# EAGLE schematic Pix_Caster (EAGLE 9.6.1)
CDES: Christian SoC Krueger; CNAME: Blizzard Bridge; CREV: 0.0.1

## Sheet 1 of 8
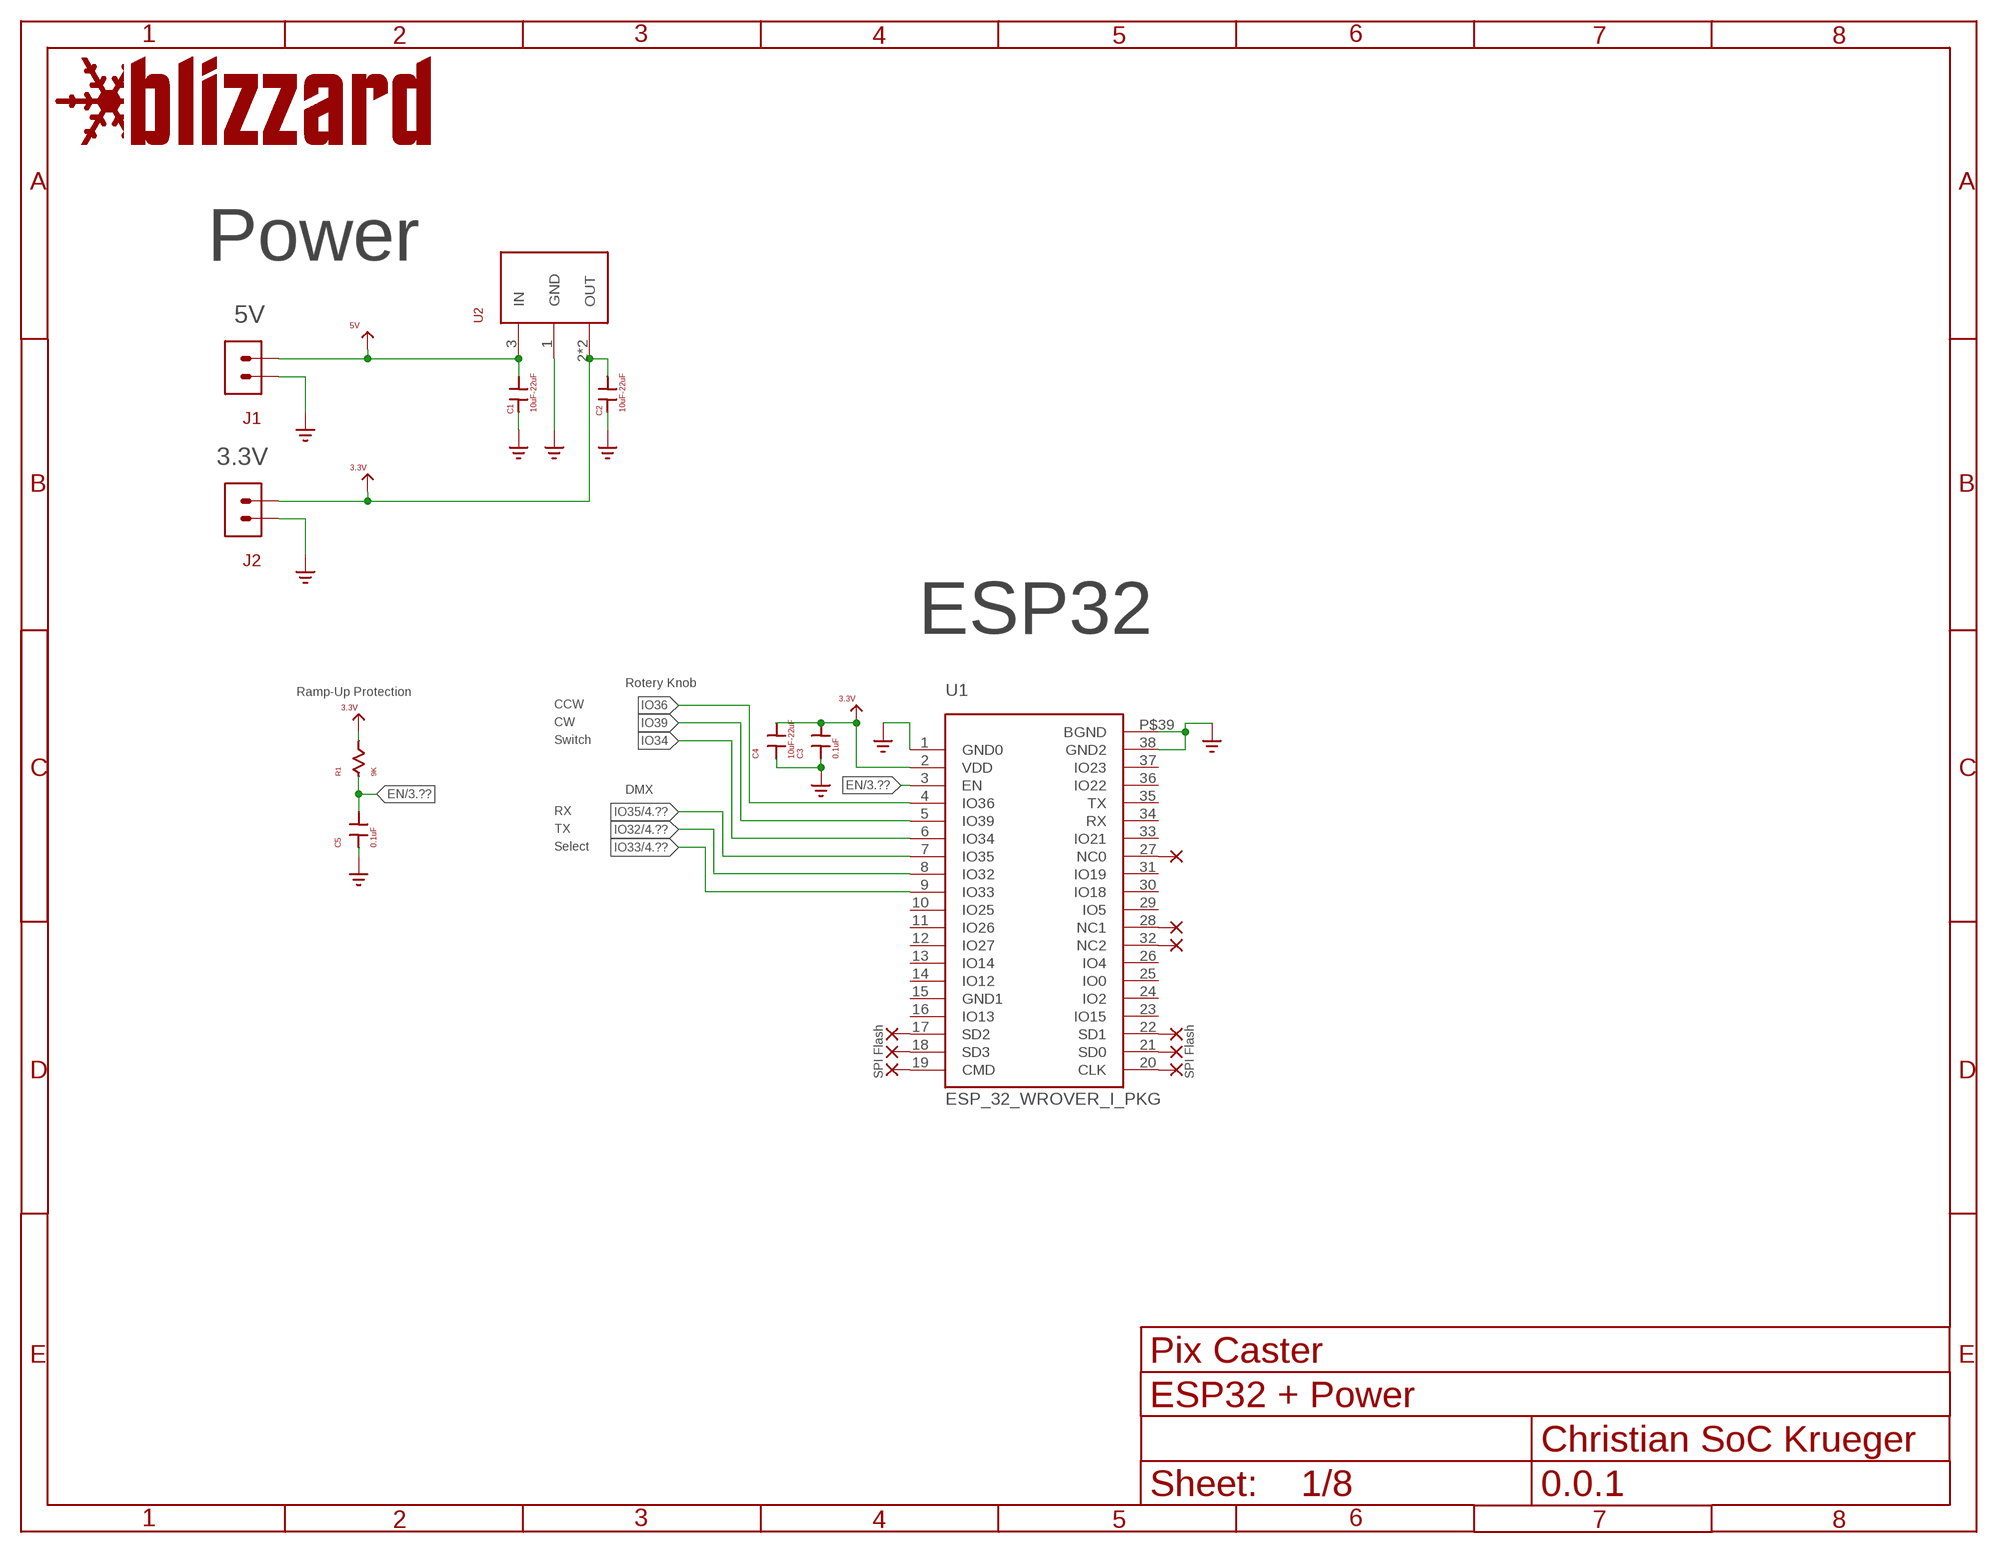
[diagram p0: schematic, sheet 1]
U$1 (BLIZZARD_FRAME_DEV): CDESC: ESP32 + Power; CNAME: Pix Caster

### Parts
C1  10uF-22uF  0603_CAP_DEV3D  [CAPC1508X55]
C2  10uF-22uF  0603_CAP_DEV3D  [CAPC1508X55]
C3  0.1uF  0603_CAP_DEV3D  [CAPC1508X55]
C4  10uF-22uF  0603_CAP_DEV3D  [CAPC1508X55]
C5  0.1uF  0603_CAP_DEV3D  [CAPC1508X55]
GND1  GND  (no package)
GND2  GND  (no package)
GND3  GND  (no package)
GND4  GND  (no package)
GND5  GND  (no package)
GND6  GND  (no package)
GND7  GND  (no package)
GND8  GND  (no package)
GND9  GND  (no package)
J1  2_POS_XH_DEV  [2_POS_XH_PKG]
J2  2_POS_XH_DEV  [2_POS_XH_PKG]
NC1  NC  (no package)
NC2  NC  (no package)
NC3  NC  (no package)
NC4  NC  (no package)
NC5  NC  (no package)
NC6  NC  (no package)
NC7  NC  (no package)
NC8  NC  (no package)
NC9  NC  (no package)
R1  9K  0603_RES_DEV3D  [RESC1608X55]
U1  ESP_32_WROVER_I_PKG  [ESP32_WROVER_I_PKG]
U2  LD1117S33CTR_DEVLD1117S33CTR  [SOT230P700X180-4]
VCC1  5V  VCC  (no package)
VCC2  3.3V  VCC  (no package)
VCC3  3.3V  VCC  (no package)
VCC4  3.3V  VCC  (no package)

### Nets
3.3V: C2.2 C3.2 C4.2 J2.2 R1.2 U1.2(VDD) U2.2(OUT) U2.4(OUT) VCC2.P$1 VCC3.P$1 VCC4.P$1 ; also sheet 2,4
5V: C1.2 J1.2 U2.3(IN) VCC1.P$1 ; also sheet 3,4
EN: C5.2 R1.1 U1.3(EN) ; also sheet 3
GND: C1.1 C2.1 C3.1 C4.1 C5.1 GND1.P$1 GND2.P$1 GND3.P$1 GND4.P$1 GND5.P$1 GND6.P$1 GND7.P$1 GND8.P$1 GND9.P$1 J1.1 J2.1 U1.1(GND0) U1.38(GND2) U1.P$39(BGND) U2.1(GND) ; also sheet 2,3,4
IO32: U1.8(IO32) ; also sheet 4
IO33: U1.9(IO33) ; also sheet 4
IO34: U1.6(IO34)
IO35: U1.7(IO35) ; also sheet 4
IO36: U1.4(IO36)
IO39: U1.5(IO39)
N$1: NC1.P$1 U1.17(SD2)
N$2: NC2.P$1 U1.18(SD3)
N$3: NC3.P$1 U1.19(CMD)
N$4: NC4.P$1 U1.20(CLK)
N$5: NC5.P$1 U1.21(SD0)
N$6: NC6.P$1 U1.22(SD1)
N$7: NC7.P$1 U1.32(NC2)
N$8: NC8.P$1 U1.28(NC1)
N$9: NC9.P$1 U1.27(NC0)
Unconnected: U1.10(IO25) U1.11(IO26) U1.12(IO27) U1.13(IO14) U1.14(IO12) U1.15(GND1) U1.16(IO13) U1.23(IO15) U1.24(IO2) U1.25(IO0) U1.26(IO4) U1.29(IO5) U1.30(IO18) U1.31(IO19) U1.33(IO21) U1.34(RX) U1.35(TX) U1.36(IO22) U1.37(IO23)

### Notes on the sheet
- Power
- 5V
- 3.3V
- ESP32
- Rotery Knob
- Ramp-Up Protection
- CCW
- CW
- Switch
- DMX
- RX
- TX
- Select
- SPI Flash | SPI Flash

## Sheet 2 of 8
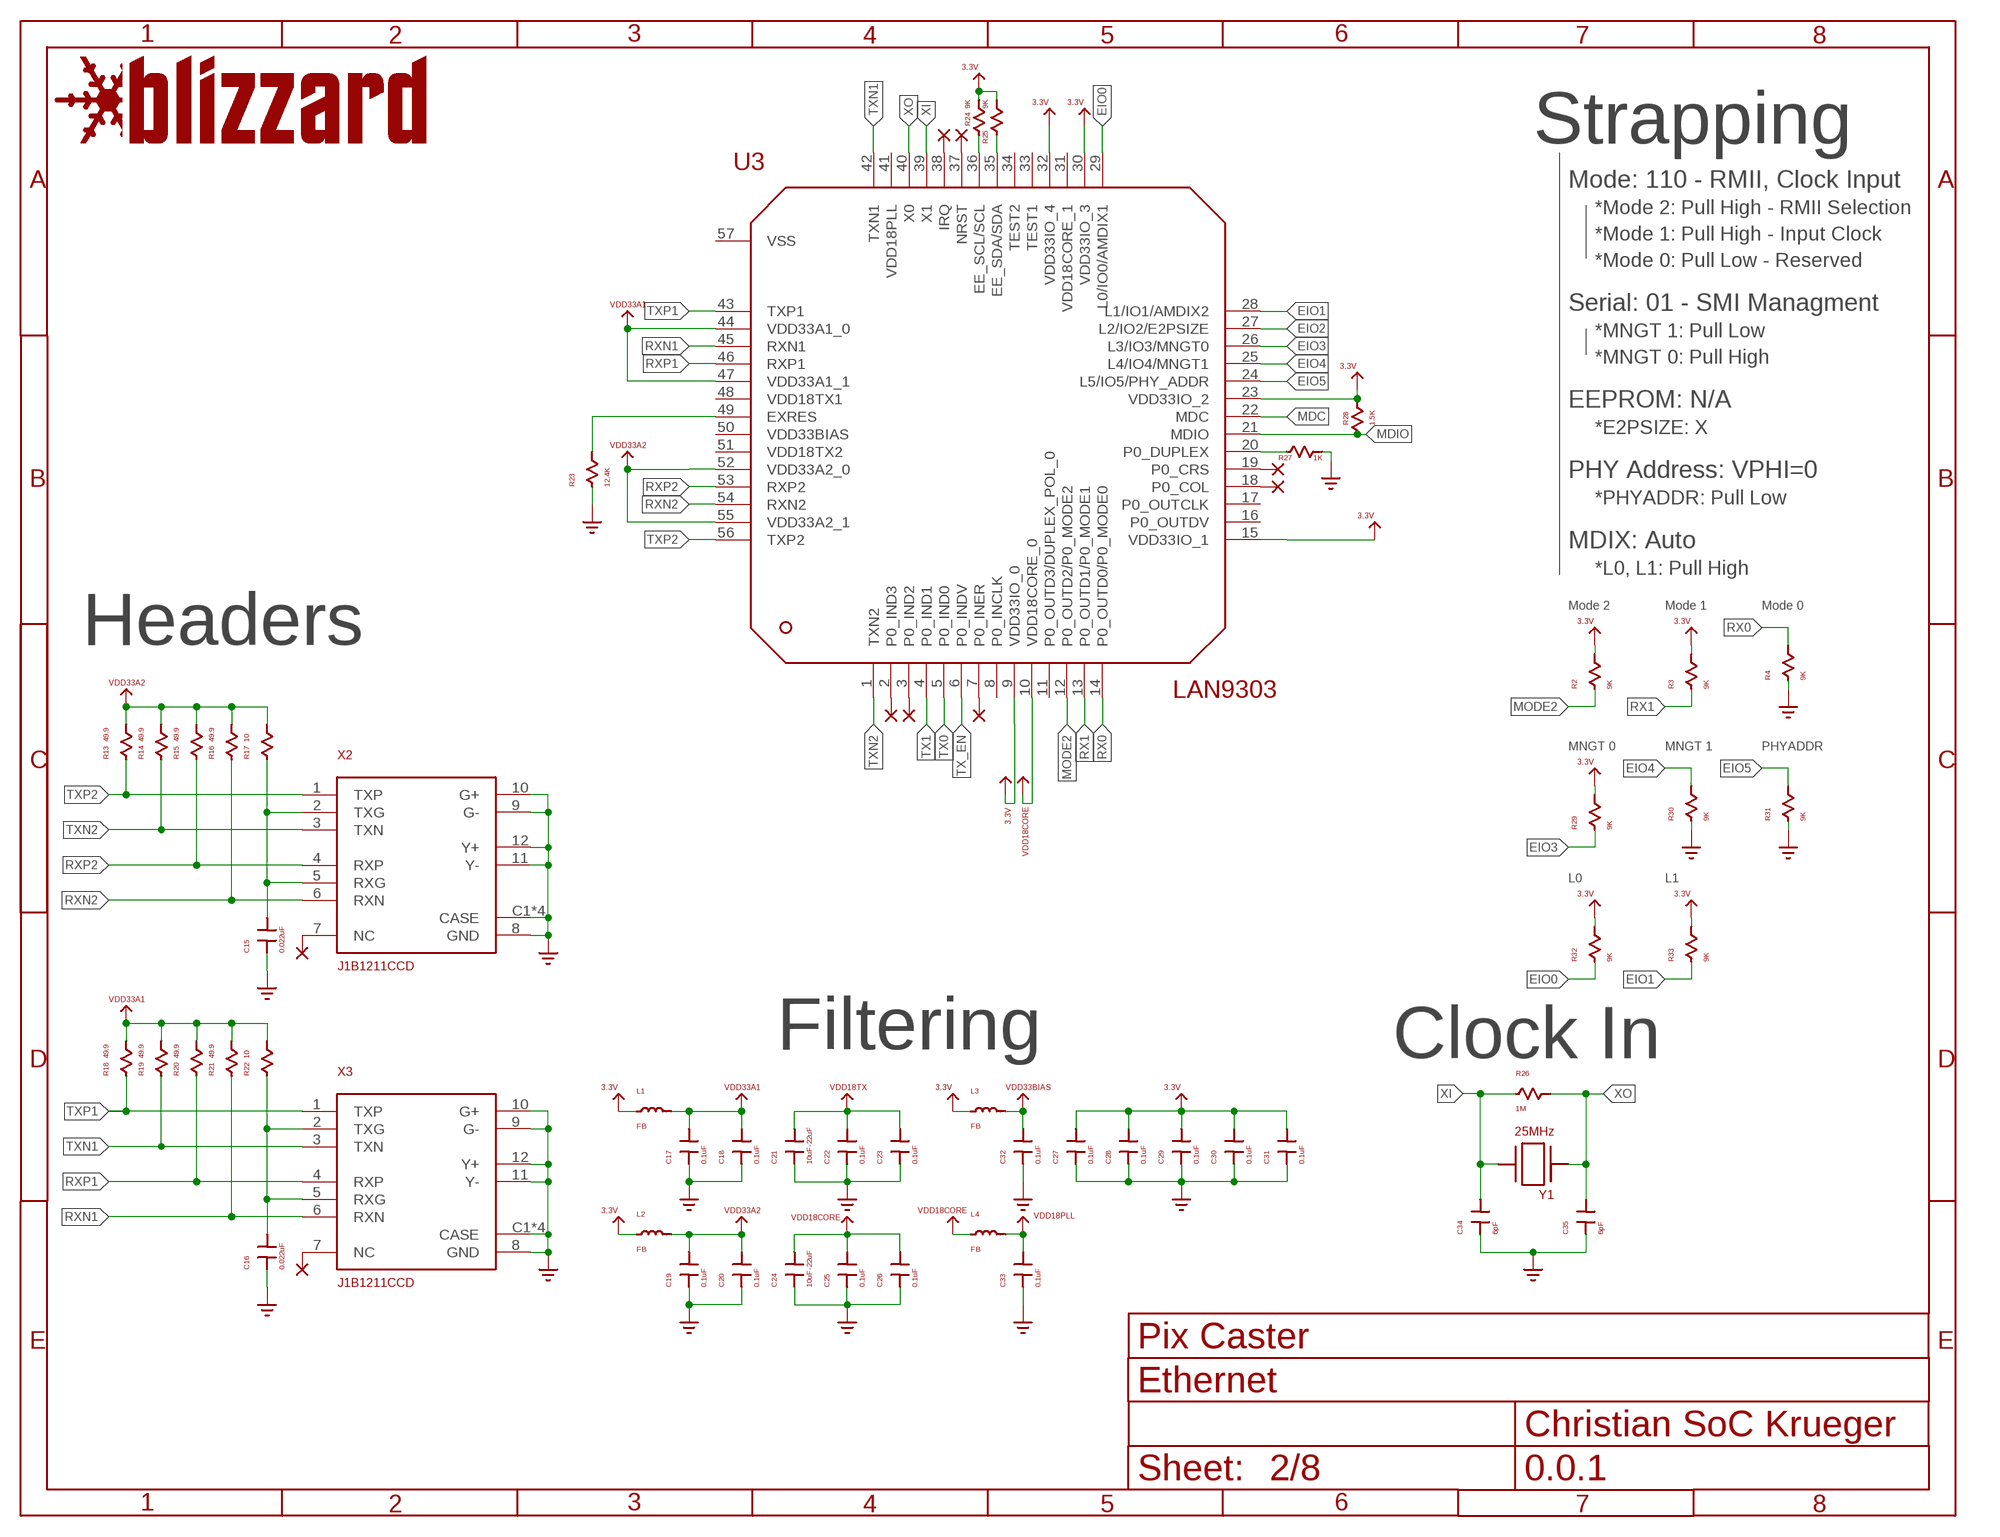
[diagram p1: schematic, sheet 2]
U$2 (BLIZZARD_FRAME_DEV): CDESC: Ethernet; CNAME: Pix Caster

### Parts
C15  0.022uF  0603_CAP_DEV3D  [CAPC1508X55]
C16  0.022uF  0603_CAP_DEV3D  [CAPC1508X55]
C17  0.1uF  0603_CAP_DEV3D  [CAPC1508X55]
C18  0.1uF  0603_CAP_DEV3D  [CAPC1508X55]
C19  0.1uF  0603_CAP_DEV3D  [CAPC1508X55]
C20  0.1uF  0603_CAP_DEV3D  [CAPC1508X55]
C21  10uF-22uF  0603_CAP_DEV3D  [CAPC1508X55]
C22  0.1uF  0603_CAP_DEV3D  [CAPC1508X55]
C23  0.1uF  0603_CAP_DEV3D  [CAPC1508X55]
C24  10uF-22uF  0603_CAP_DEV3D  [CAPC1508X55]
C25  0.1uF  0603_CAP_DEV3D  [CAPC1508X55]
C26  0.1uF  0603_CAP_DEV3D  [CAPC1508X55]
C27  0.1uF  0603_CAP_DEV3D  [CAPC1508X55]
C28  0.1uF  0603_CAP_DEV3D  [CAPC1508X55]
C29  0.1uF  0603_CAP_DEV3D  [CAPC1508X55]
C30  0.1uF  0603_CAP_DEV3D  [CAPC1508X55]
C31  0.1uF  0603_CAP_DEV3D  [CAPC1508X55]
C32  0.1uF  0603_CAP_DEV3D  [CAPC1508X55]
C33  0.1uF  0603_CAP_DEV3D  [CAPC1508X55]
C34  6pF  0603_CAP_DEV3D  [CAPC1508X55]
C35  6pF  0603_CAP_DEV3D  [CAPC1508X55]
GND10  GND  (no package)
GND22  GND  (no package)
GND23  GND  (no package)
GND24  GND  (no package)
GND25  GND  (no package)
GND26  GND  (no package)
GND27  GND  (no package)
GND28  GND  (no package)
GND29  GND  (no package)
GND30  GND  (no package)
GND31  GND  (no package)
GND32  GND  (no package)
GND33  GND  (no package)
GND34  GND  (no package)
GND35  GND  (no package)
GND36  GND  (no package)
GND37  GND  (no package)
L1  FB  0603_IND_DEV3D  [INDC1508X55]
L2  FB  0603_IND_DEV3D  [INDC1508X55]
L3  FB  0603_IND_DEV3D  [INDC1508X55]
L4  FB  0603_IND_DEV3D  [INDC1508X55]
NC16  NC  (no package)
NC17  NC  (no package)
NC26  NC  (no package)
NC27  NC  (no package)
NC28  NC  (no package)
NC29  NC  (no package)
NC30  NC  (no package)
NC31  NC  (no package)
NC32  NC  (no package)
R2  9K  0603_RES_DEV3D  [RESC1608X55]
R3  9K  0603_RES_DEV3D  [RESC1608X55]
R4  9K  0603_RES_DEV3D  [RESC1608X55]
R13  49.9  0603_RES_DEV3D  [RESC1608X55]
R14  49.9  0603_RES_DEV3D  [RESC1608X55]
R15  49.9  0603_RES_DEV3D  [RESC1608X55]
R16  49.9  0603_RES_DEV3D  [RESC1608X55]
R17  10  0603_RES_DEV3D  [RESC1608X55]
R18  49.9  0603_RES_DEV3D  [RESC1608X55]
R19  49.9  0603_RES_DEV3D  [RESC1608X55]
R20  49.9  0603_RES_DEV3D  [RESC1608X55]
R21  49.9  0603_RES_DEV3D  [RESC1608X55]
R22  10  0603_RES_DEV3D  [RESC1608X55]
R23  12.4K  0603_RES_DEV3D  [RESC1608X55]
R24  9K  0603_RES_DEV3D  [RESC1608X55]
R25  9K  0603_RES_DEV3D  [RESC1608X55]
R26  1M  0603_RES_DEV3D  [RESC1608X55]
R27  1K  0603_RES_DEV3D  [RESC1608X55]
R28  1.5K  0603_RES_DEV3D  [RESC1608X55]
R29  9K  0603_RES_DEV3D  [RESC1608X55]
R30  9K  0603_RES_DEV3D  [RESC1608X55]
R31  9K  0603_RES_DEV3D  [RESC1608X55]
R32  9K  0603_RES_DEV3D  [RESC1608X55]
R33  9K  0603_RES_DEV3D  [RESC1608X55]
U3  LAN9303_DEVQFN56  [QFN50P800X800X100-57T600]
VCC5  3.3V  VCC  (no package)
VCC6  3.3V  VCC  (no package)
VCC19  VDD33A2  VCC  (no package)
VCC20  VDD33A1  VCC  (no package)
VCC21  VDD33A2  VCC  (no package)
VCC22  VDD33A1  VCC  (no package)
VCC23  3.3V  VCC  (no package)
VCC24  3.3V  VCC  (no package)
VCC25  VDD33A1  VCC  (no package)
VCC26  3.3V  VCC  (no package)
VCC27  VDD33A2  VCC  (no package)
VCC28  VDD18TX  VCC  (no package)
VCC29  VDD18CORE  VCC  (no package)
VCC30  3.3V  VCC  (no package)
VCC31  3.3V  VCC  (no package)
VCC32  VDD33BIAS  VCC  (no package)
VCC33  VDD18CORE  VCC  (no package)
VCC34  VDD18PLL  VCC  (no package)
VCC35  3.3V  VCC  (no package)
VCC36  3.3V  VCC  (no package)
VCC37  3.3V  VCC  (no package)
VCC38  3.3V  VCC  (no package)
VCC39  3.3V  VCC  (no package)
VCC40  VDD18CORE  VCC  (no package)
VCC41  3.3V  VCC  (no package)
VCC42  3.3V  VCC  (no package)
VCC43  3.3V  VCC  (no package)
X2  J1B1211CCD_DEV  [J1B1211CCD_PKG]
X3  J1B1211CCD_DEV  [J1B1211CCD_PKG]
Y1  25MHz  ABLS-25.000MHZ-B4-F-T_DEVHC-49/US  [XTAL1140X470X420]

### Nets
3.3V: C27.2 C28.2 C29.2 C30.2 C31.2 L1.1 R2.2 R3.2 R24.2 R25.2 R28.2 U3.9(VDD33IO_0) U3.15(VDD33IO_1) U3.23(VDD33IO_2) U3.30(VDD33IO_3) U3.32(VDD33IO_4) VCC5.P$1 VCC6.P$1 VCC23.P$1 VCC24.P$1 VCC30.P$1 VCC35.P$1 VCC36.P$1 VCC37.P$1 VCC38.P$1 VCC39.P$1 ; also sheet 1,4
3.3V1: L2.1 VCC26.P$1
3.3V2: L3.1 VCC31.P$1
3.3V3: R29.2 VCC41.P$1
3.3V4: R32.2 R33.2 VCC42.P$1 VCC43.P$1
EIO0: R32.1 U3.29(L0/IO0/AMDIX1)
EIO1: R33.1 U3.28(L1/IO1/AMDIX2)
EIO2: U3.27(L2/IO2/E2PSIZE)
EIO3: R29.1 U3.26(L3/IO3/MNGT0)
EIO4: R30.2 U3.25(L4/IO4/MNGT1)
EIO5: R31.2 U3.24(L5/IO5/PHY_ADDR)
GND: C17.1 C18.1 C21.1 C22.1 C23.1 C27.1 C28.1 C29.1 C30.1 C31.1 C34.1 C35.1 GND10.P$1 GND23.P$1 GND26.P$1 GND27.P$1 GND29.P$1 GND31.P$1 GND34.P$1 GND35.P$1 R4.1 R23.1 R27.2 X2.8(GND) X2.9(G-) X2.10(G+) X2.11(Y-) X2.12(Y+) X2.C1(CASE) X2.C2(CASE) X2.C3(CASE) X2.C4(CASE) ; also sheet 1,3,4
GND1: GND22.P$1 X3.8(GND) X3.9(G-) X3.10(G+) X3.11(Y-) X3.12(Y+) X3.C1(CASE) X3.C2(CASE) X3.C3(CASE) X3.C4(CASE)
GND2: C19.1 C20.1 GND28.P$1
GND3: C24.1 C25.1 C26.1 GND30.P$1
GND4: GND36.P$1 R30.1
GND5: GND37.P$1 R31.1
MDC: U3.22(MDC)
MDIO: R28.1 U3.21(MDIO)
MODE2: R2.1 U3.12(P0_OUTD2/P0_MODE2)
N$22: C15.2 R17.1 X2.2(TXG) X2.5(RXG)
N$23: C16.2 R22.1 X3.2(TXG) X3.5(RXG)
N$24: C15.1 GND24.P$1
N$25: NC17.P$1 X3.7(NC)
N$28: NC16.P$1 X2.7(NC)
N$31: C16.1 GND25.P$1
N$32: R23.2 U3.49(EXRES)
N$33: R24.1 U3.36(EE_SCL/SCL)
N$38: R25.1 U3.35(EE_SDA/SDA)
N$39: NC26.P$1 U3.37(NRST)
N$40: C32.1 GND32.P$1
N$41: C33.1 GND33.P$1
N$42: NC27.P$1 U3.7(P0_INER)
N$43: NC28.P$1 U3.2(P0_IND3)
N$44: NC29.P$1 U3.19(P0_CRS)
N$45: NC30.P$1 U3.18(P0_COL)
N$46: NC31.P$1 U3.3(P0_IND2)
N$47: R27.1 U3.20(P0_DUPLEX)
N$48: NC32.P$1 U3.38(IRQ)
RX0: R4.2 U3.14(P0_OUTD0/P0_MODE0)
RX1: R3.1 U3.13(P0_OUTD1/P0_MODE1)
RXN1: R21.1 U3.45(RXN1) X3.6(RXN)
RXN2: R16.1 U3.54(RXN2) X2.6(RXN)
RXP1: R20.1 U3.46(RXP1) X3.4(RXP)
RXP2: R15.1 U3.53(RXP2) X2.4(RXP)
TX0: U3.5(P0_IND0)
TX1: U3.4(P0_IND1)
TX_EN: U3.6(P0_INDV)
TXN1: R19.1 U3.42(TXN1) X3.3(TXN)
TXN2: R14.1 U3.1(TXN2) X2.3(TXN)
TXP1: R18.1 U3.43(TXP1) X3.1(TXP)
TXP2: R13.1 U3.56(TXP2) X2.1(TXP)
VDD18CORE: L4.1 U3.10(VDD18CORE_0) VCC33.P$1 VCC40.P$1
VDD18PLL: C33.2 L4.2 VCC34.P$1
VDD18TX: C21.2 C22.2 C23.2 VCC28.P$1
VDD18TX1: C24.2 C25.2 C26.2 VCC29.P$1
VDD33A1: C17.2 C18.2 L1.2 R18.2 R19.2 R20.2 R21.2 R22.2 U3.44(VDD33A1_0) U3.47(VDD33A1_1) VCC20.P$1 VCC22.P$1 VCC25.P$1
VDD33A2: C19.2 C20.2 L2.2 R13.2 R14.2 R15.2 R16.2 R17.2 U3.52(VDD33A2_0) U3.55(VDD33A2_1) VCC19.P$1 VCC21.P$1 VCC27.P$1
VDD33BIAS: C32.2 L3.2 VCC32.P$1
XI: C34.2 R26.1 U3.39(X1) Y1.2
XO: C35.2 R26.2 U3.40(X0) Y1.1
Unconnected: U3.8(P0_INCLK) U3.11(P0_OUTD3/DUPLEX_POL_0) U3.16(P0_OUTDV) U3.17(P0_OUTCLK) U3.31(VDD18CORE_1) U3.33(TEST1) U3.34(TEST2) U3.41(VDD18PLL) U3.48(VDD18TX1) U3.50(VDD33BIAS) U3.51(VDD18TX2) U3.57(VSS)

### Notes on the sheet
- Strapping
- Mode: 110 - RMII, Clock Input
- *Mode 2: Pull High - RMII Selection
- *Mode 1: Pull High - Input Clock
- *Mode 0: Pull Low - Reserved
- Serial: 01 - SMI Managment
- *MNGT 1: Pull Low
- *MNGT 0: Pull High
- EEPROM: N/A
- *E2PSIZE: X
- PHY Address: VPHI=0
- *PHYADDR: Pull Low
- MDIX: Auto
- *L0, L1: Pull High
- Mode 2 | Mode 1 | Mode 0
- Headers
- MNGT 0 | MNGT 1 | PHYADDR
- L0 | L1
- Filtering | Clock In

## Sheet 3 of 8
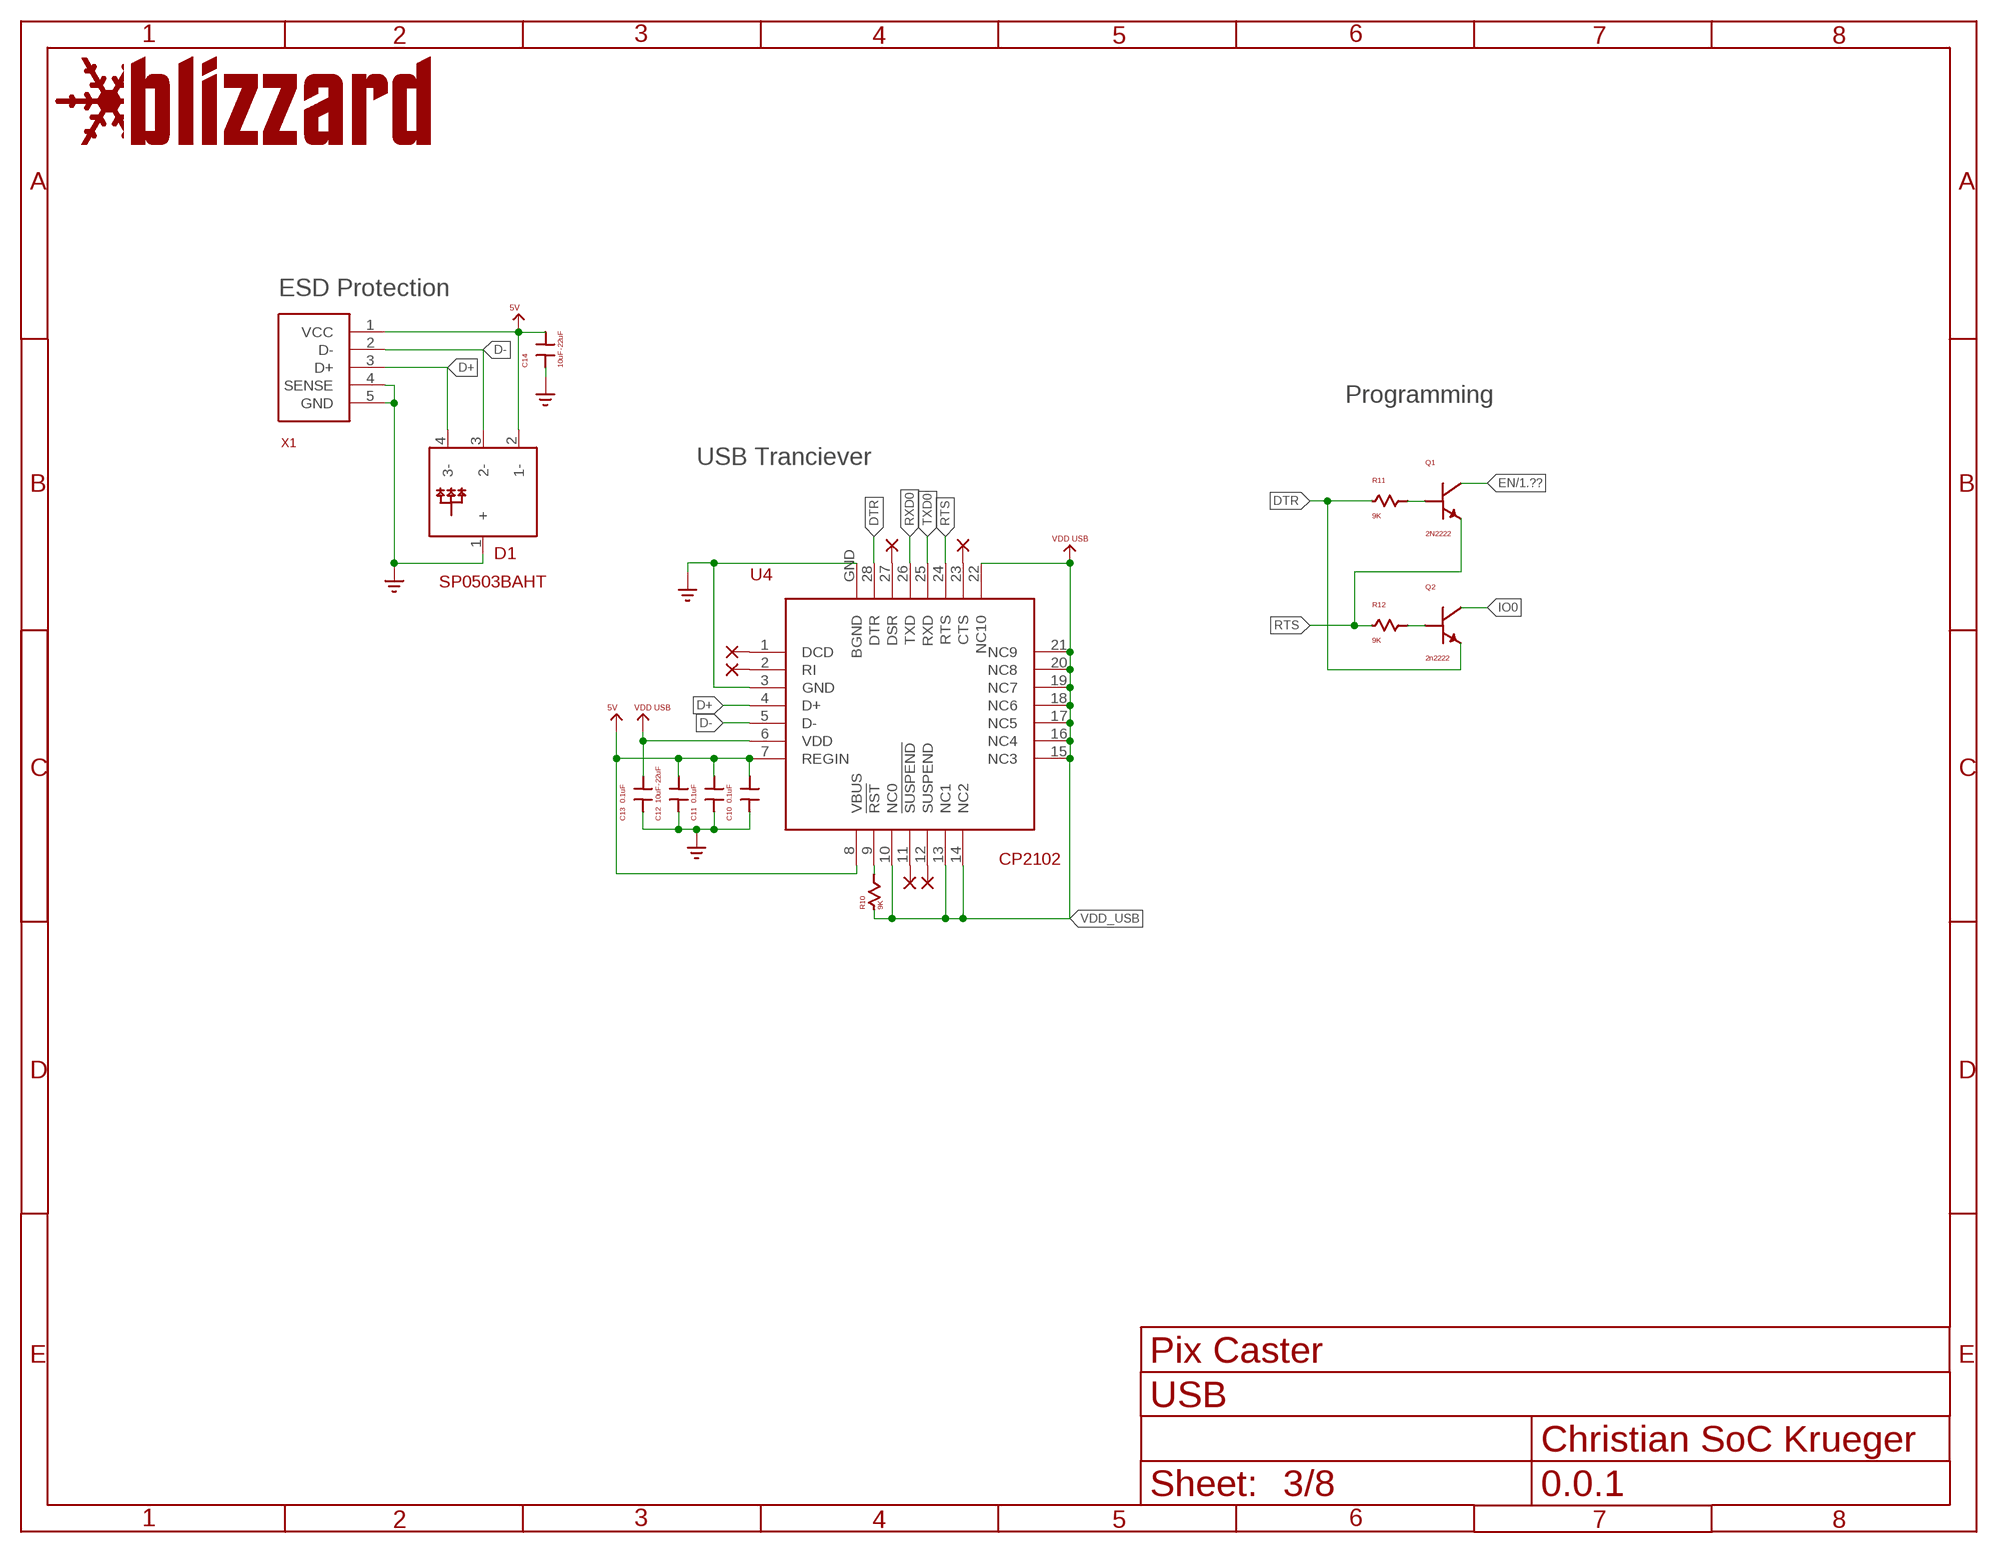
[diagram p2: schematic, sheet 3]
U$3 (BLIZZARD_FRAME_DEV): CDESC: USB; CNAME: Pix Caster

### Parts
C10  0.1uF  0603_CAP_DEV3D  [CAPC1508X55]
C11  0.1uF  0603_CAP_DEV3D  [CAPC1508X55]
C12  10uF-22uF  0603_CAP_DEV3D  [CAPC1508X55]
C13  0.1uF  0603_CAP_DEV3D  [CAPC1508X55]
C14  10uF-22uF  0603_CAP_DEV3D  [CAPC1508X55]
D1  USB_ESD_DEVSOT143  [SOT192P237X122-4]
GND18  GND  (no package)
GND19  GND  (no package)
GND20  GND  (no package)
GND21  GND  (no package)
NC10  NC  (no package)
NC11  NC  (no package)
NC12  NC  (no package)
NC13  NC  (no package)
NC14  NC  (no package)
NC15  NC  (no package)
Q1  2N2222  SOT23_TRANS3D  [SOT95P242X120-3]
Q2  2n2222  SOT23_TRANS3D  [SOT95P242X120-3]
R10  9K  0603_RES_DEV3D  [RESC1608X55]
R11  9K  0603_RES_DEV3D  [RESC1608X55]
R12  9K  0603_RES_DEV3D  [RESC1608X55]
U4  USB_TO_UART_DEV  [QFN50P500X500X100-28]
VCC15  VDD USB  VCC  (no package)
VCC16  VDD USB  VCC  (no package)
VCC17  5V  VCC  (no package)
VCC18  5V  VCC  (no package)
X1  USB_ALI_DEV  [CHEAP_USB]

### Nets
5V: C10.2 C11.2 C12.2 C14.2 D1.2(1-) U4.7(REGIN) U4.8(VBUS) VCC17.P$1 VCC18.P$1 X1.1(VCC) ; also sheet 1,4
D+: D1.4(3-) U4.4(D+) X1.3(D+)
D-: D1.3(2-) U4.5(D-) X1.2(D-)
DTR: Q2.2(E) R11.1 U4.28(DTR)
EN: Q1.3(C) ; also sheet 1
GND: C10.1 C11.1 C12.1 C13.1 C14.1 D1.1(+) GND18.P$1 GND19.P$1 GND20.P$1 GND21.P$1 U4.3(GND) U4.GND(BGND) X1.4(SENSE) X1.5(GND) ; also sheet 1,2,4
IO0: Q2.3(C)
N$13: NC10.P$1 U4.1(DCD)
N$14: NC11.P$1 U4.2(RI)
N$15: NC12.P$1 U4.11(!SUSPEND)
N$16: NC13.P$1 U4.12(SUSPEND)
N$17: NC14.P$1 U4.23(CTS)
N$18: NC15.P$1 U4.27(DSR)
N$19: Q1.1(B) R11.2
N$20: R10.2 U4.9(!RST)
N$21: Q2.1(B) R12.2
RTS: Q1.2(E) R12.1 U4.24(RTS)
RXD0: U4.26(TXD)
TXD0: U4.25(RXD)
VDD_USB: C13.2 R10.1 U4.6(VDD) U4.10(NC0) U4.13(NC1) U4.14(NC2) U4.15(NC3) U4.16(NC4) U4.17(NC5) U4.18(NC6) U4.19(NC7) U4.20(NC8) U4.21(NC9) U4.22(NC10) VCC15.P$1 VCC16.P$1

### Notes on the sheet
- ESD Protection
- Programming
- USB Tranciever

## Sheet 4 of 8
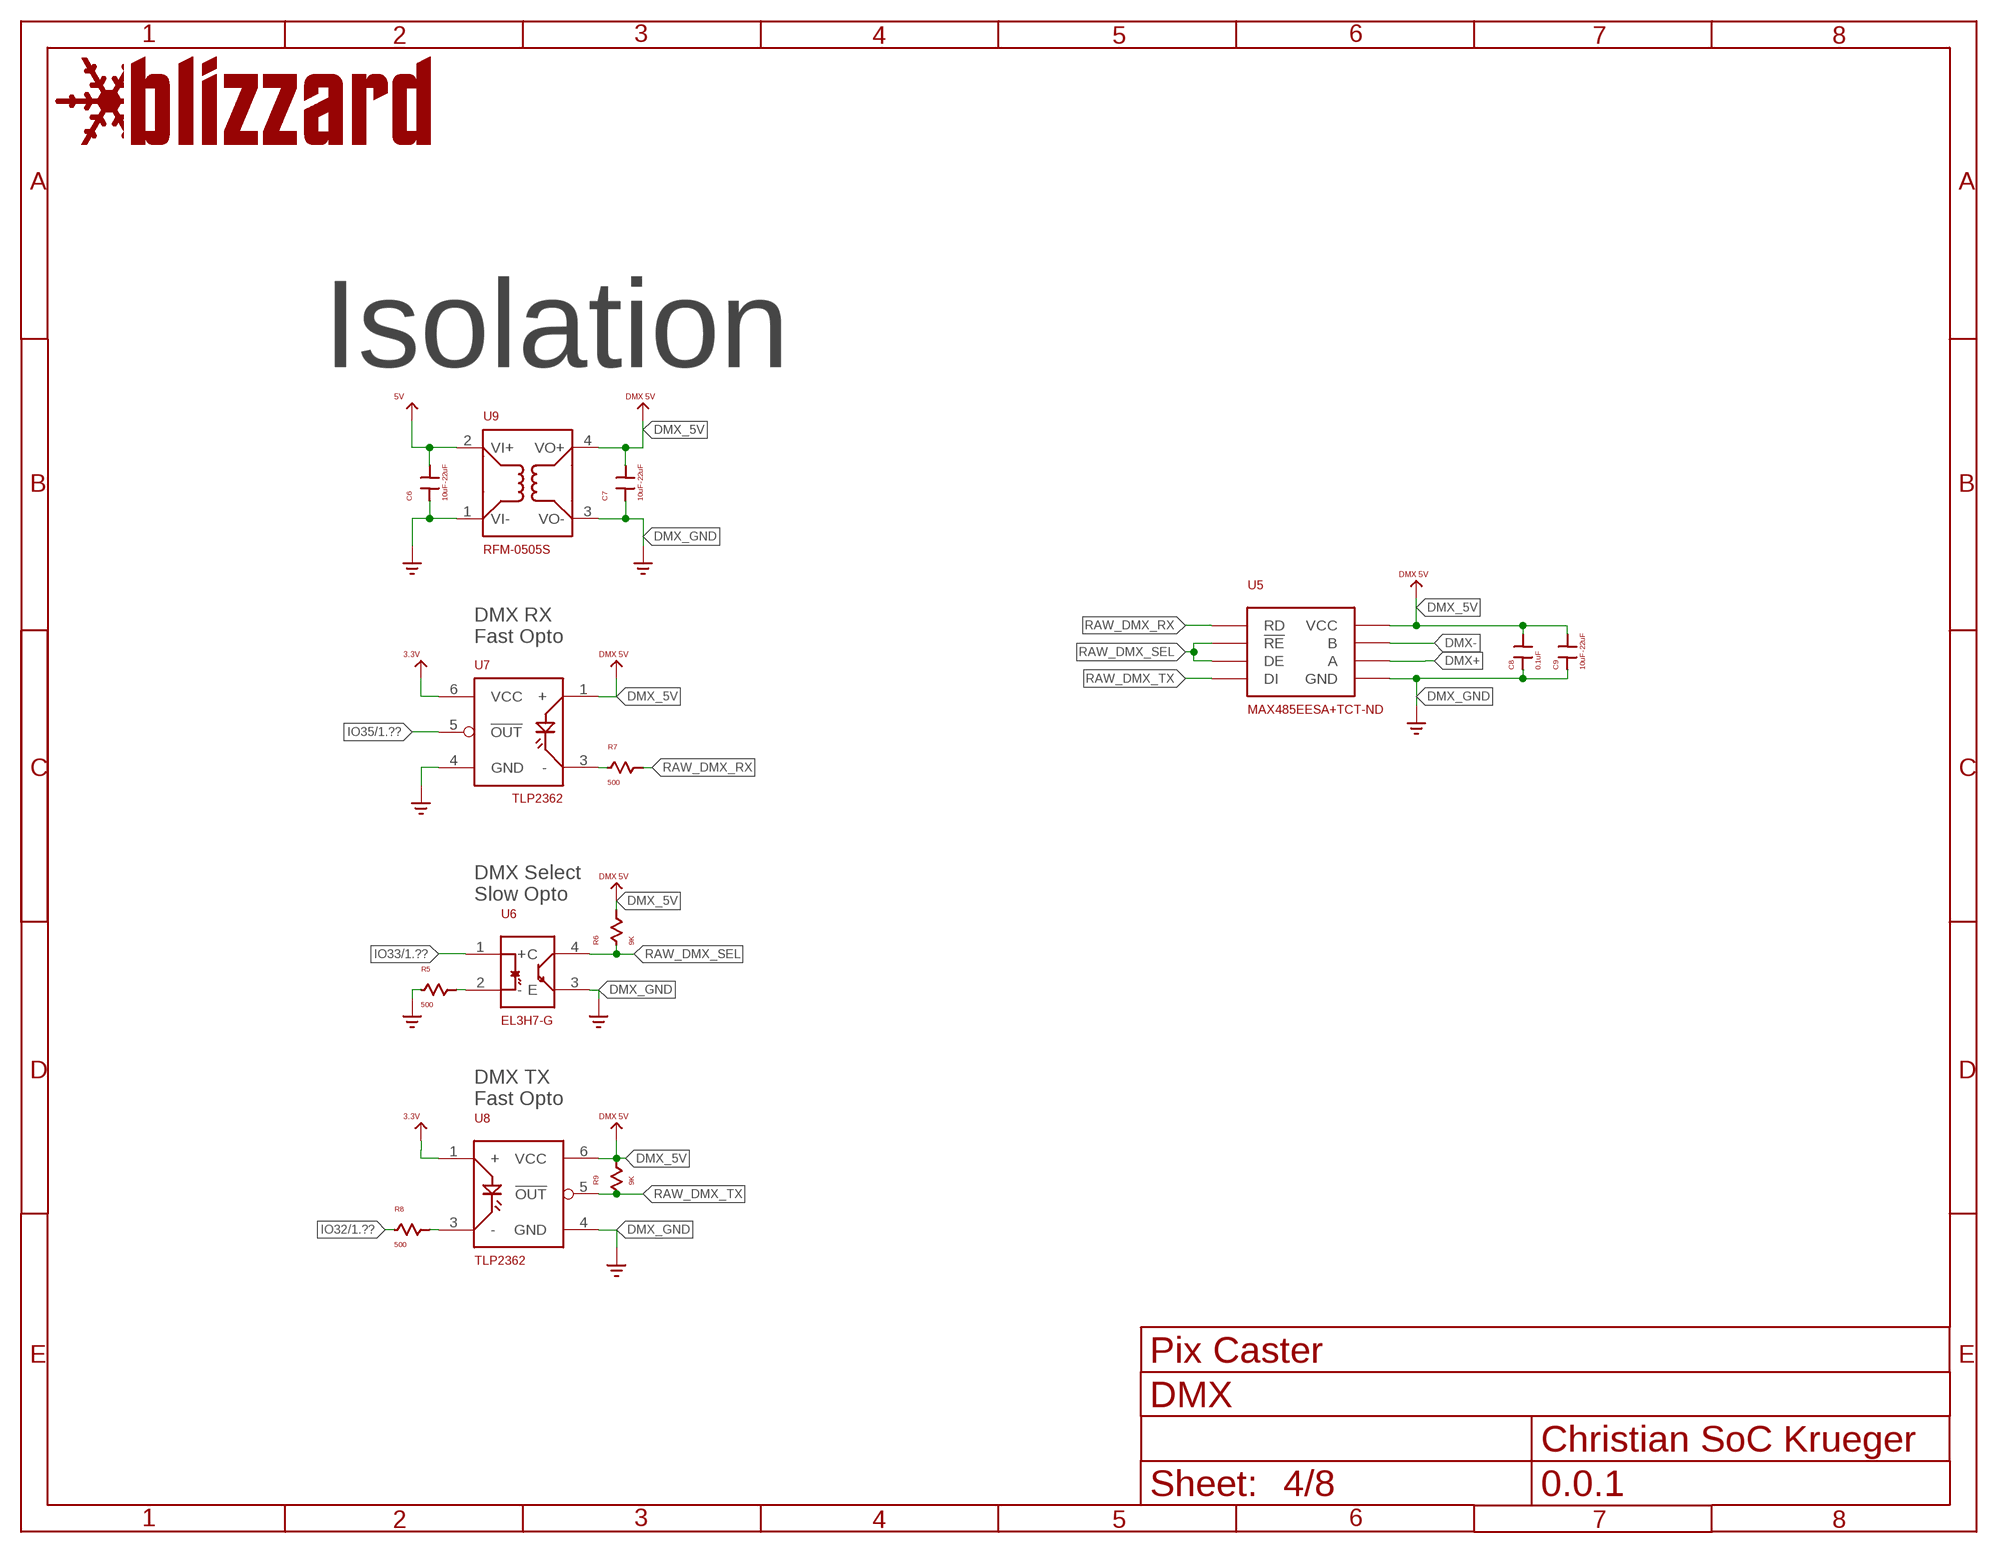
[diagram p3: schematic, sheet 4]
U$4 (BLIZZARD_FRAME_DEV): CDESC: DMX; CNAME: Pix Caster

### Parts
C6  10uF-22uF  0603_CAP_DEV3D  [CAPC1508X55]
C7  10uF-22uF  0603_CAP_DEV3D  [CAPC1508X55]
C8  0.1uF  0603_CAP_DEV3D  [CAPC1508X55]
C9  10uF-22uF  0603_CAP_DEV3D  [CAPC1508X55]
GND11  GND  (no package)
GND12  GND  (no package)
GND13  GND  (no package)
GND14  GND  (no package)
GND15  GND  (no package)
GND16  GND  (no package)
GND17  GND  (no package)
R5  500  0603_RES_DEV3D  [RESC1608X55]
R6  9K  0603_RES_DEV3D  [RESC1608X55]
R7  500  0603_RES_DEV3D  [RESC1608X55]
R8  500  0603_RES_DEV3D  [RESC1608X55]
R9  9K  0603_RES_DEV3D  [RESC1608X55]
U5  MAX_485_DEV3D  [SOIC127P600X175-8]
U6  EL3H7_DEV4-SSOP  [SOIC127P700X200-4]
U7  TLP2362_DEV6-SO_5LEAD  [SOIC127P700X220-6]
U8  TLP2362_DEV6-SO_5LEAD  [SOIC127P700X220-6]
U9  RFM-0505S_DEV  [RECOM_4_SIP_PKG]
VCC7  DMX 5V  VCC  (no package)
VCC8  DMX 5V  VCC  (no package)
VCC9  5V  VCC  (no package)
VCC10  DMX 5V  VCC  (no package)
VCC11  DMX 5V  VCC  (no package)
VCC12  3.3V  VCC  (no package)
VCC13  3.3V  VCC  (no package)
VCC14  DMX 5V  VCC  (no package)

### Nets
3.3V: U7.6(VCC) U8.1(+) VCC12.P$1 VCC13.P$1 ; also sheet 1,2
5V: C6.2 U9.2(VI+) VCC9.P$1 ; also sheet 1,3
DMX+: U5.6(A)
DMX-: U5.7(B)
DMX_5V: C7.2 C8.2 C9.2 R6.2 R9.2 U5.8(VCC) U7.1(+) U8.6(VCC) U9.4(VO+) VCC7.P$1 VCC8.P$1 VCC10.P$1 VCC11.P$1 VCC14.P$1
DMX_GND: C7.1 C8.1 C9.1 GND11.P$1 GND12.P$1 GND15.P$1 GND17.P$1 U5.5(GND) U6.3(E) U8.4(GND) U9.3(VO-)
GND: C6.1 GND13.P$1 GND14.P$1 GND16.P$1 R5.1 U7.4(GND) U9.1(VI-) ; also sheet 1,2,3
IO32: R8.1 ; also sheet 1
IO33: U6.1(+) ; also sheet 1
IO35: U7.5(!OUT) ; also sheet 1
N$10: R5.2 U6.2(-)
N$11: R7.1 U7.3(-)
N$12: R8.2 U8.3(-)
RAW_DMX_RX: R7.2 U5.1(RD)
RAW_DMX_SEL: R6.1 U5.2(!RE) U5.3(DE) U6.4(C)
RAW_DMX_TX: R9.1 U5.4(DI) U8.5(!OUT)

### Notes on the sheet
- Isolation
- DMX RX
  Fast Opto
- DMX Select
  Slow Opto
- DMX TX
  Fast Opto

## Sheet 5 of 8
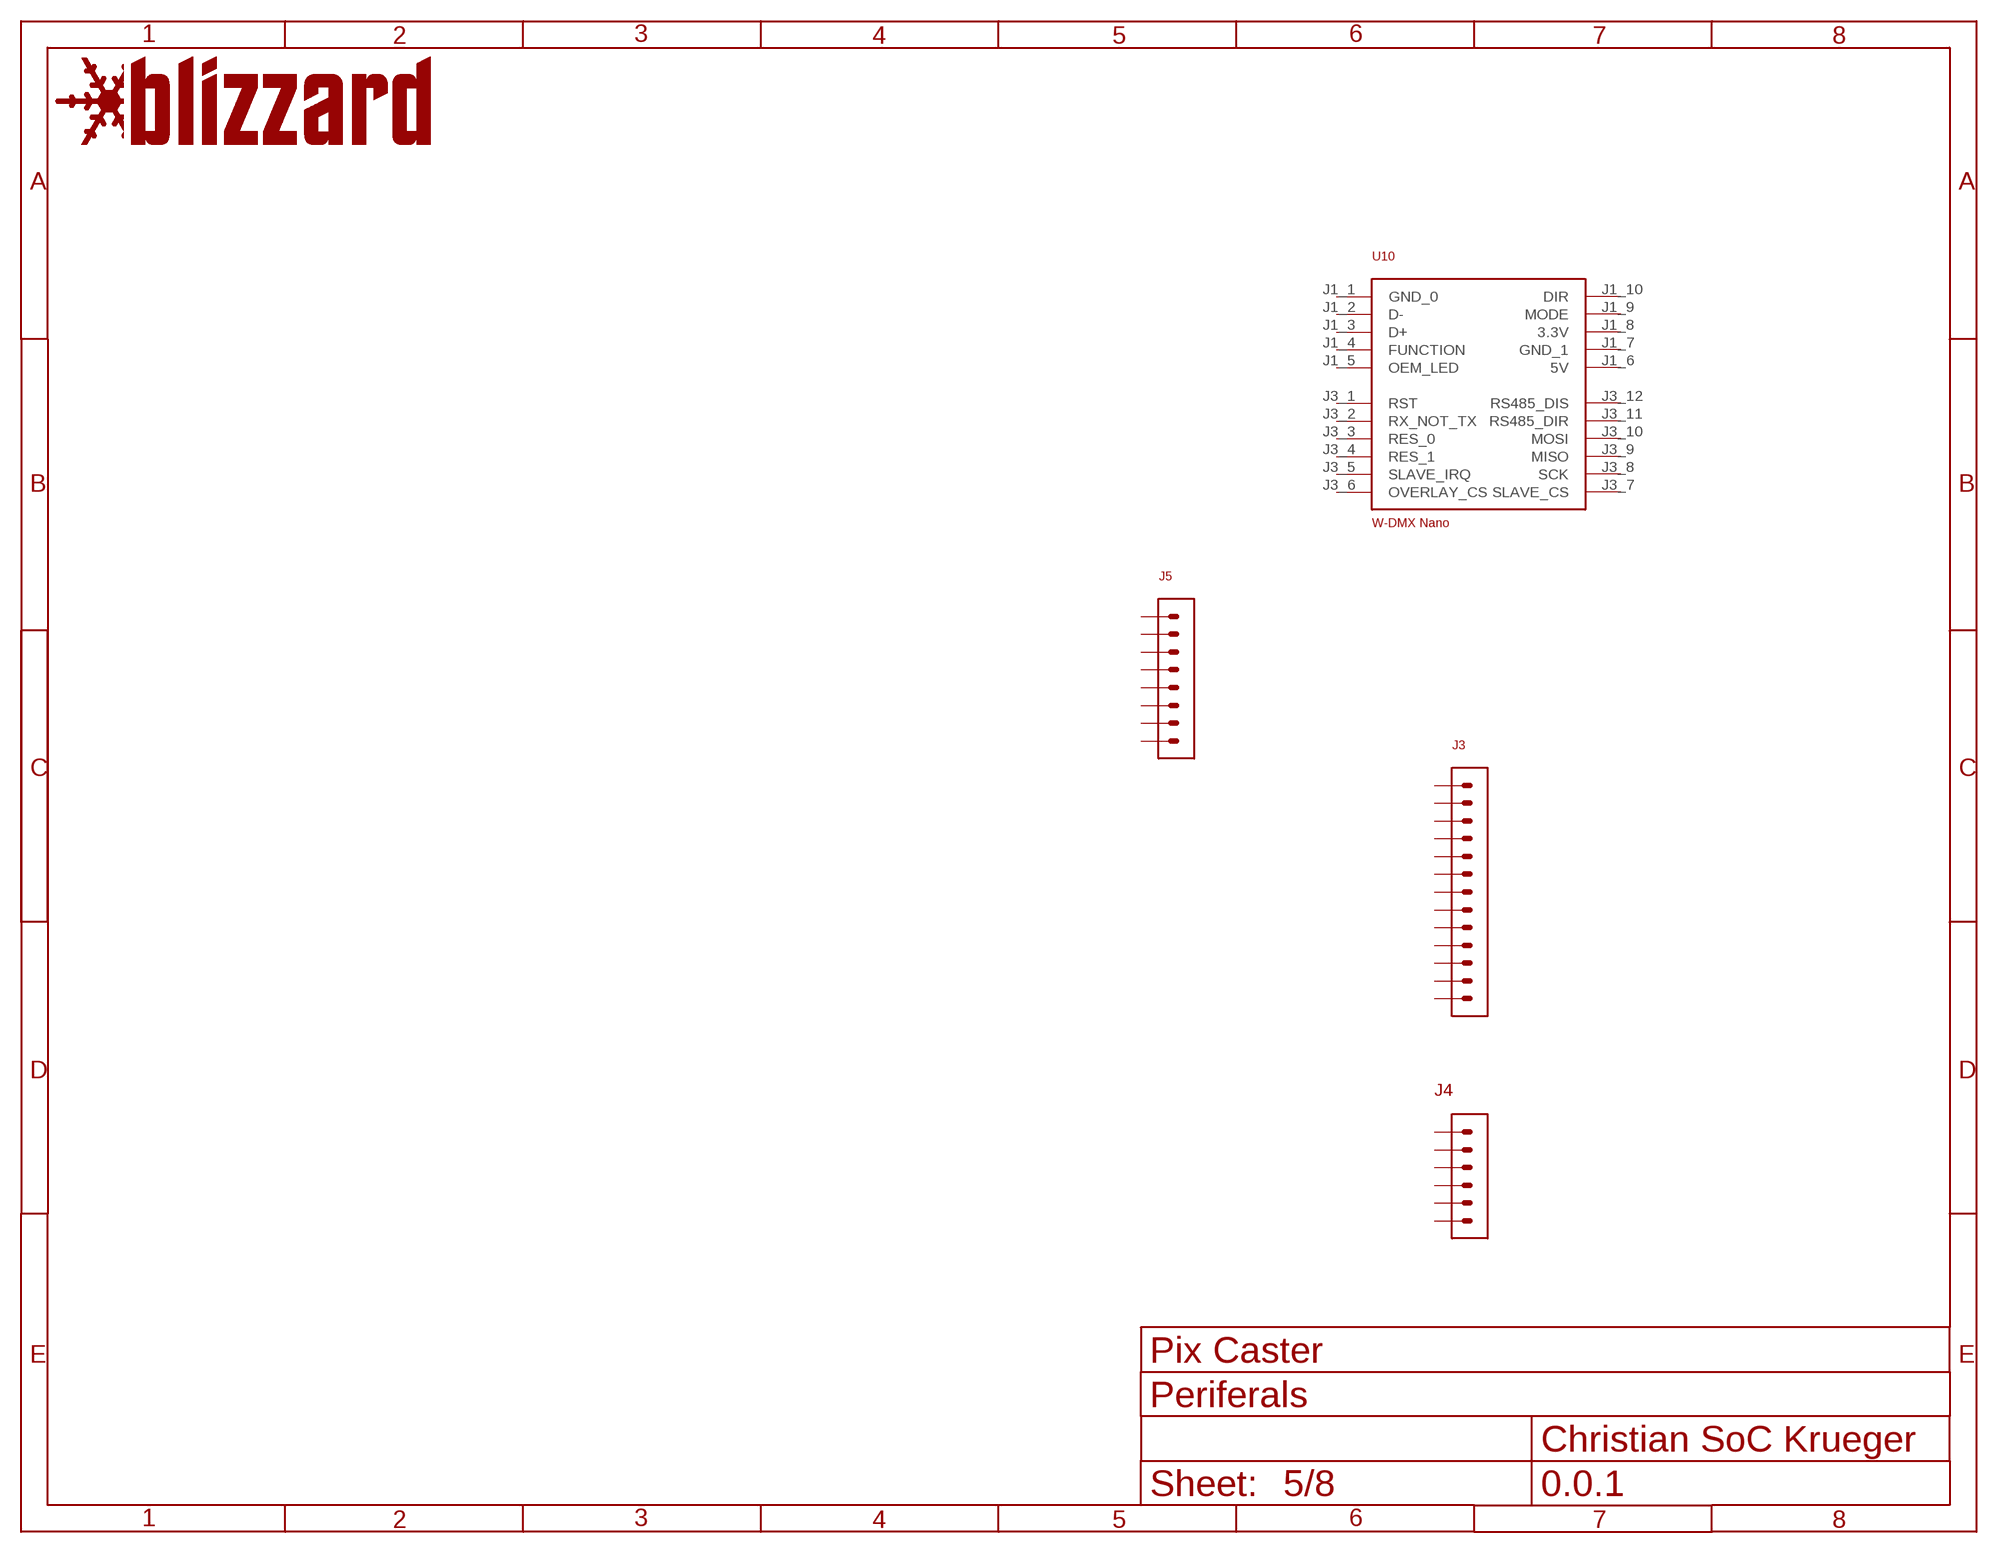
[diagram p4: schematic, sheet 5]
U$5 (BLIZZARD_FRAME_DEV): CDESC: Periferals; CNAME: Pix Caster

### Parts
J3  13_POS_XH_DEV  [13_POS_XH_PKG]
J4  6_POS_XH_DEV  [6_POS_XH_PKG]
J5  8_POS_XH_DEV  [8_POS_XH_PKG]
U10  WDMX_NANO_DEV  [WDMX_NANO_PKG]
Unconnected: J3.1 J3.2 J3.3 J3.4 J3.5 J3.6 J3.7 J3.8 J3.9 J3.10 J3.11 J3.12 J3.13 J4.1 J4.2 J4.3 J4.4 J4.5 J4.6 J5.1 J5.2 J5.3 J5.4 J5.5 J5.6 J5.7 J5.8 U10.J1_1(GND_0) U10.J1_2(D-) U10.J1_3(D+) U10.J1_4(FUNCTION) U10.J1_5(OEM_LED) U10.J1_6(5V) U10.J1_7(GND_1) U10.J1_8(3.3V) U10.J1_9(MODE) U10.J1_10(DIR) U10.J3_1(RST) U10.J3_2(RX_NOT_TX) U10.J3_3(RES_0) U10.J3_4(RES_1) U10.J3_5(SLAVE_IRQ) U10.J3_6(OVERLAY_CS) U10.J3_7(SLAVE_CS) U10.J3_8(SCK) U10.J3_9(MISO) U10.J3_10(MOSI) U10.J3_11(RS485_DIR) U10.J3_12(RS485_DIS)

## Sheet 6 of 8
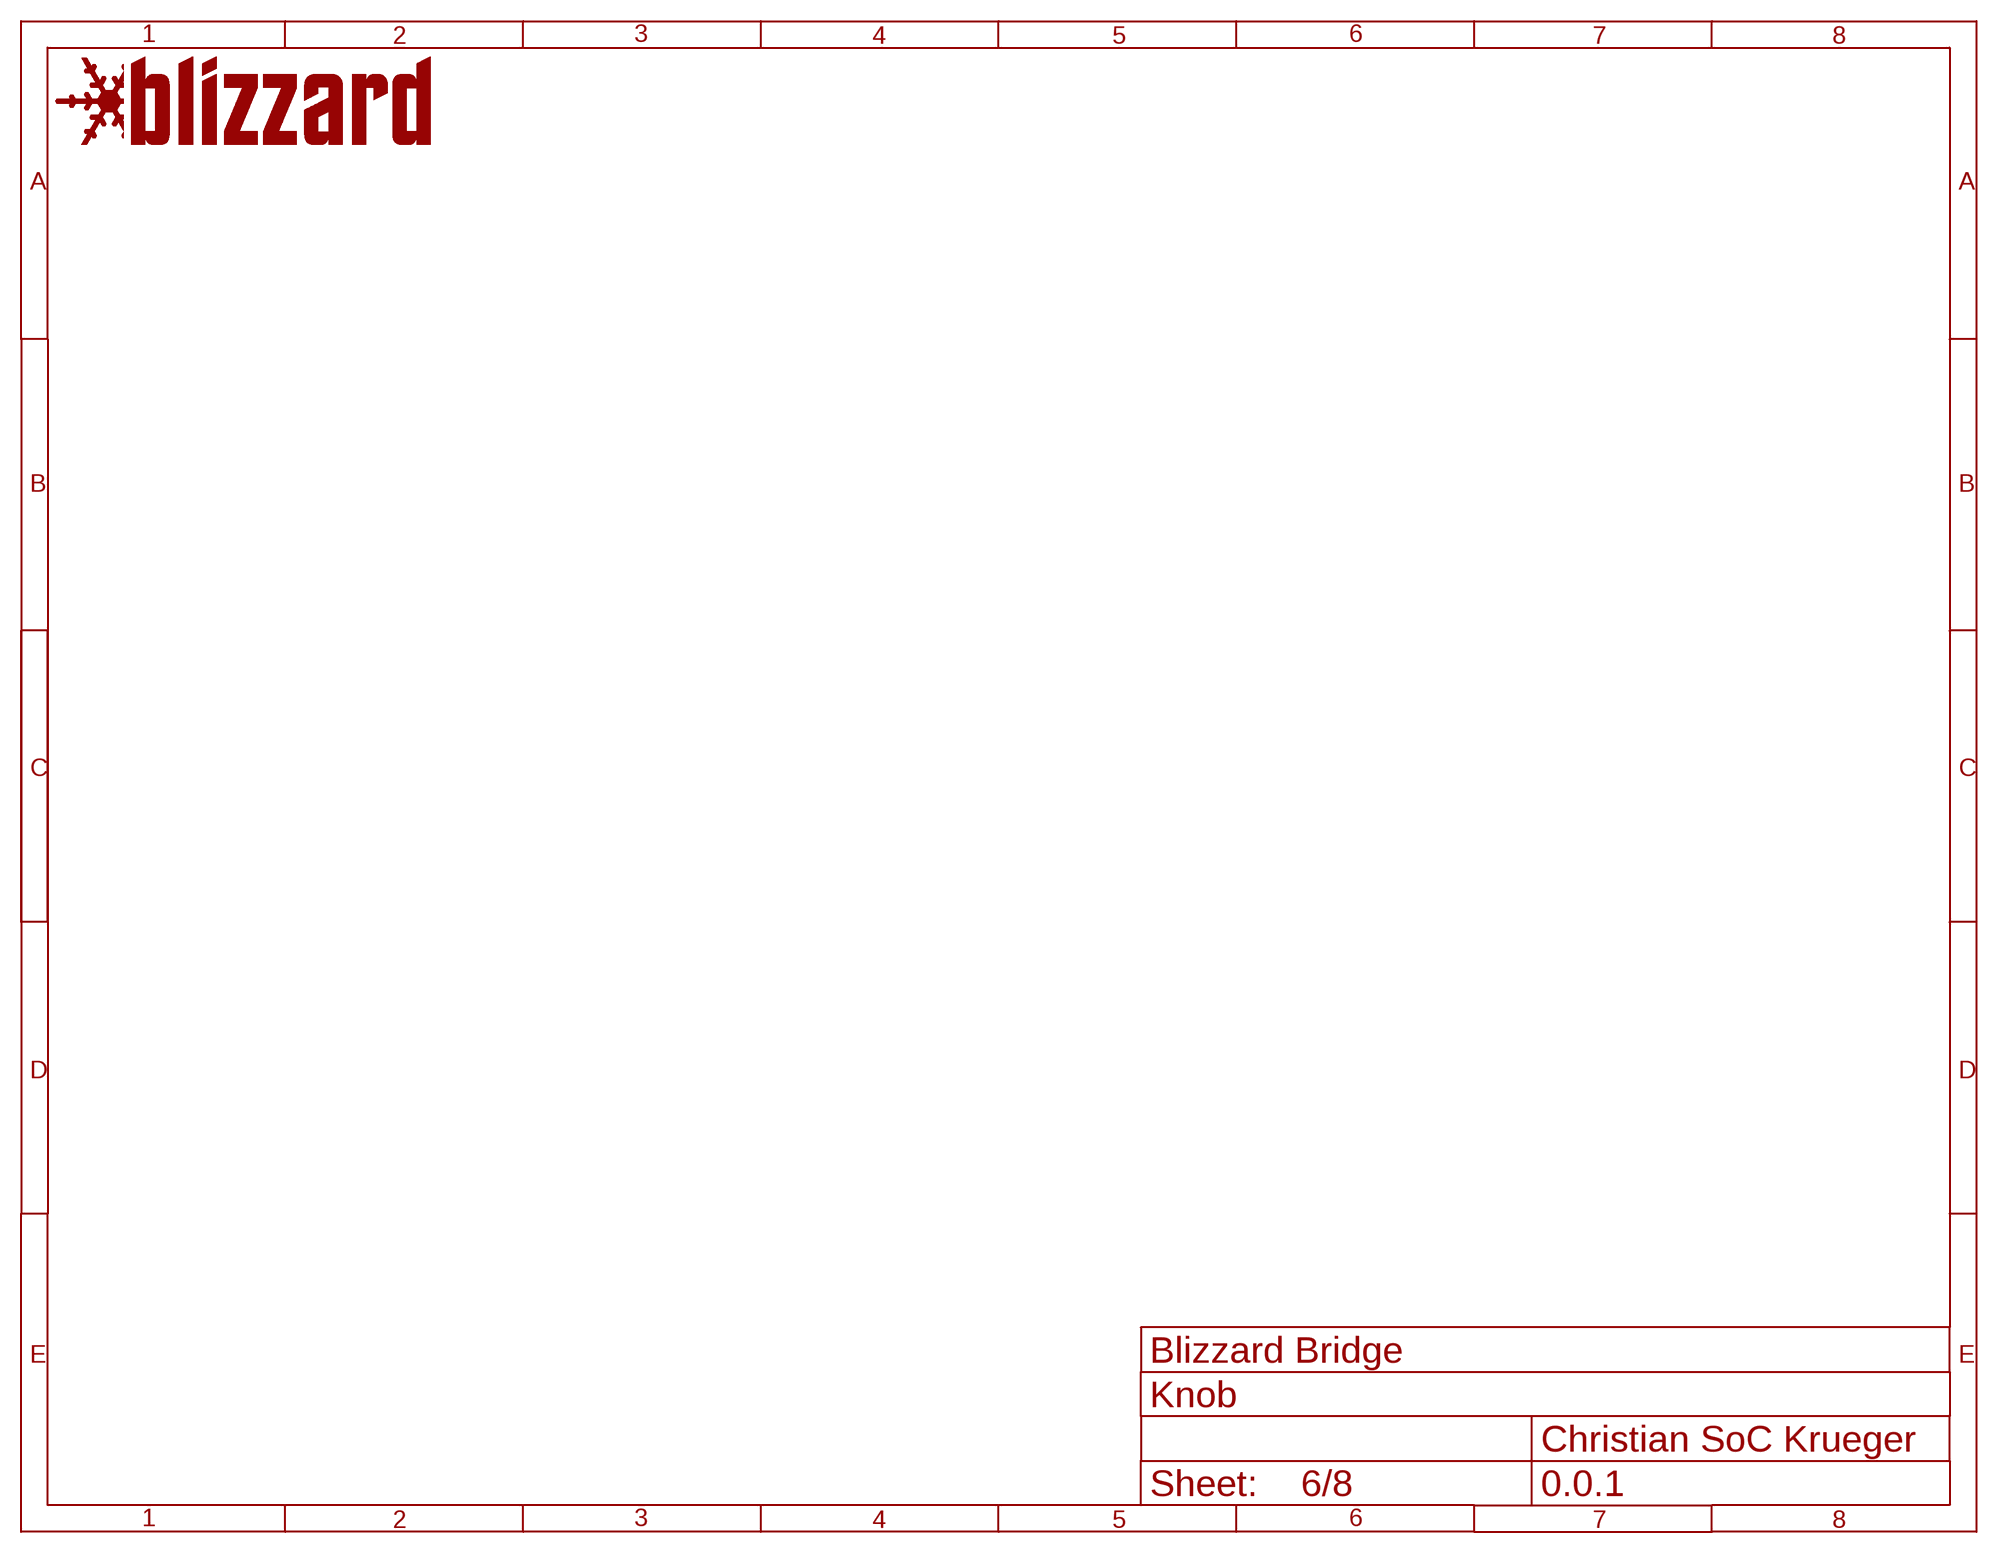
[diagram p5: schematic, sheet 6]
U$6 (BLIZZARD_FRAME_DEV): CDESC: Knob

## Sheet 7 of 8
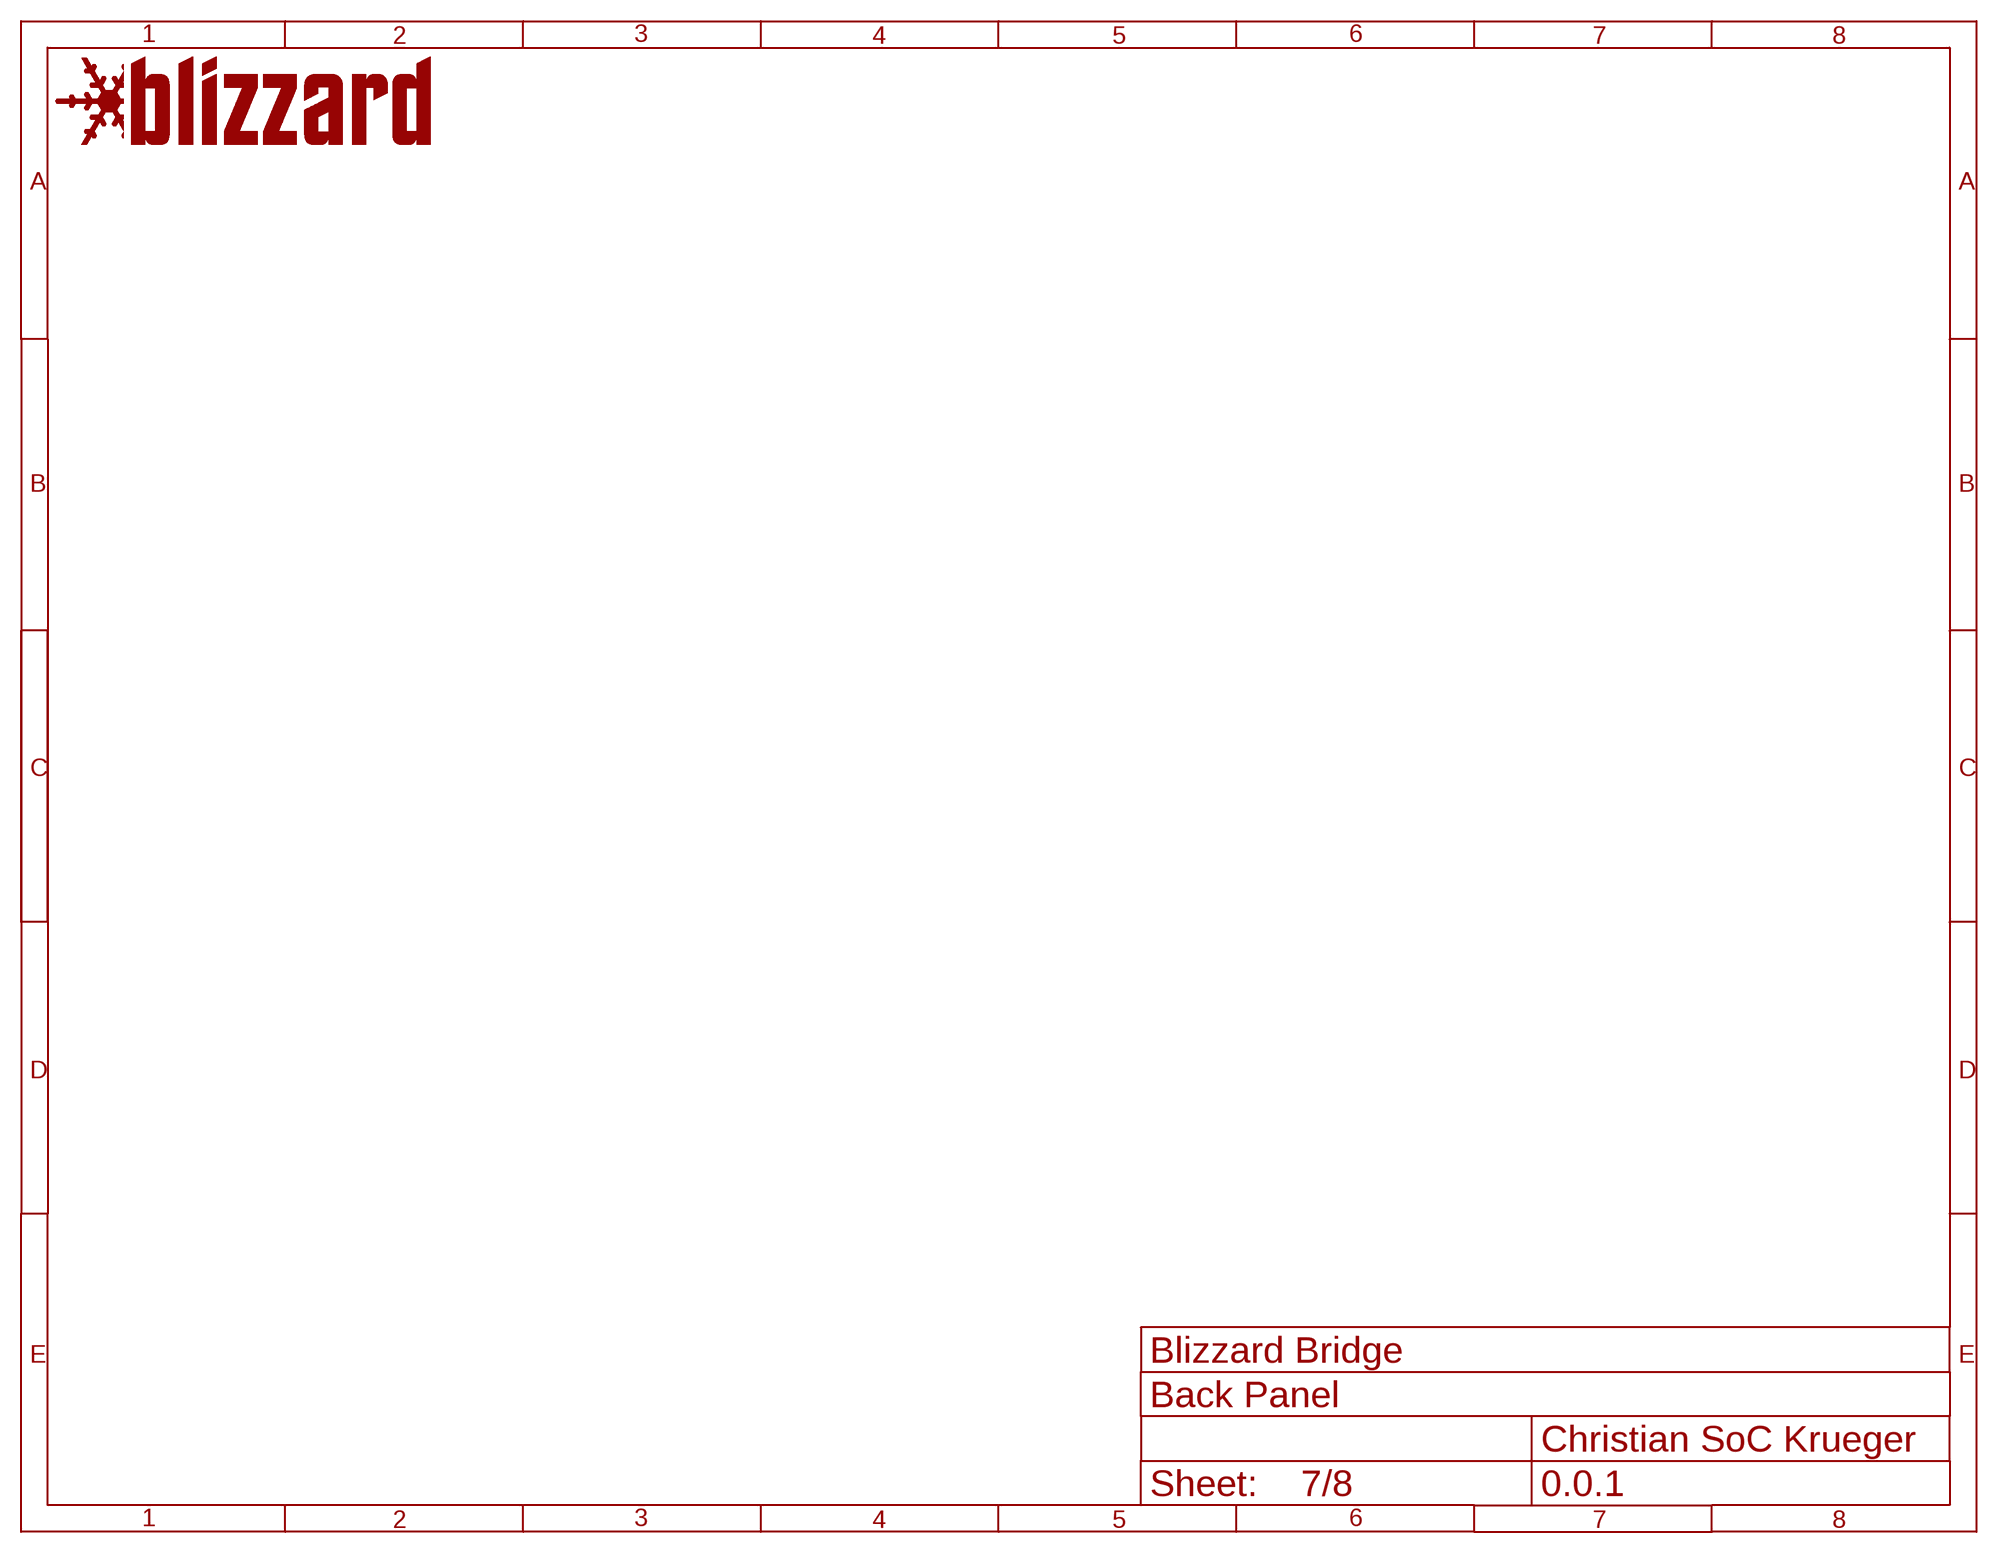
[diagram p6: schematic, sheet 7]
U$7 (BLIZZARD_FRAME_DEV): CDESC: Back Panel

## Sheet 8 of 8
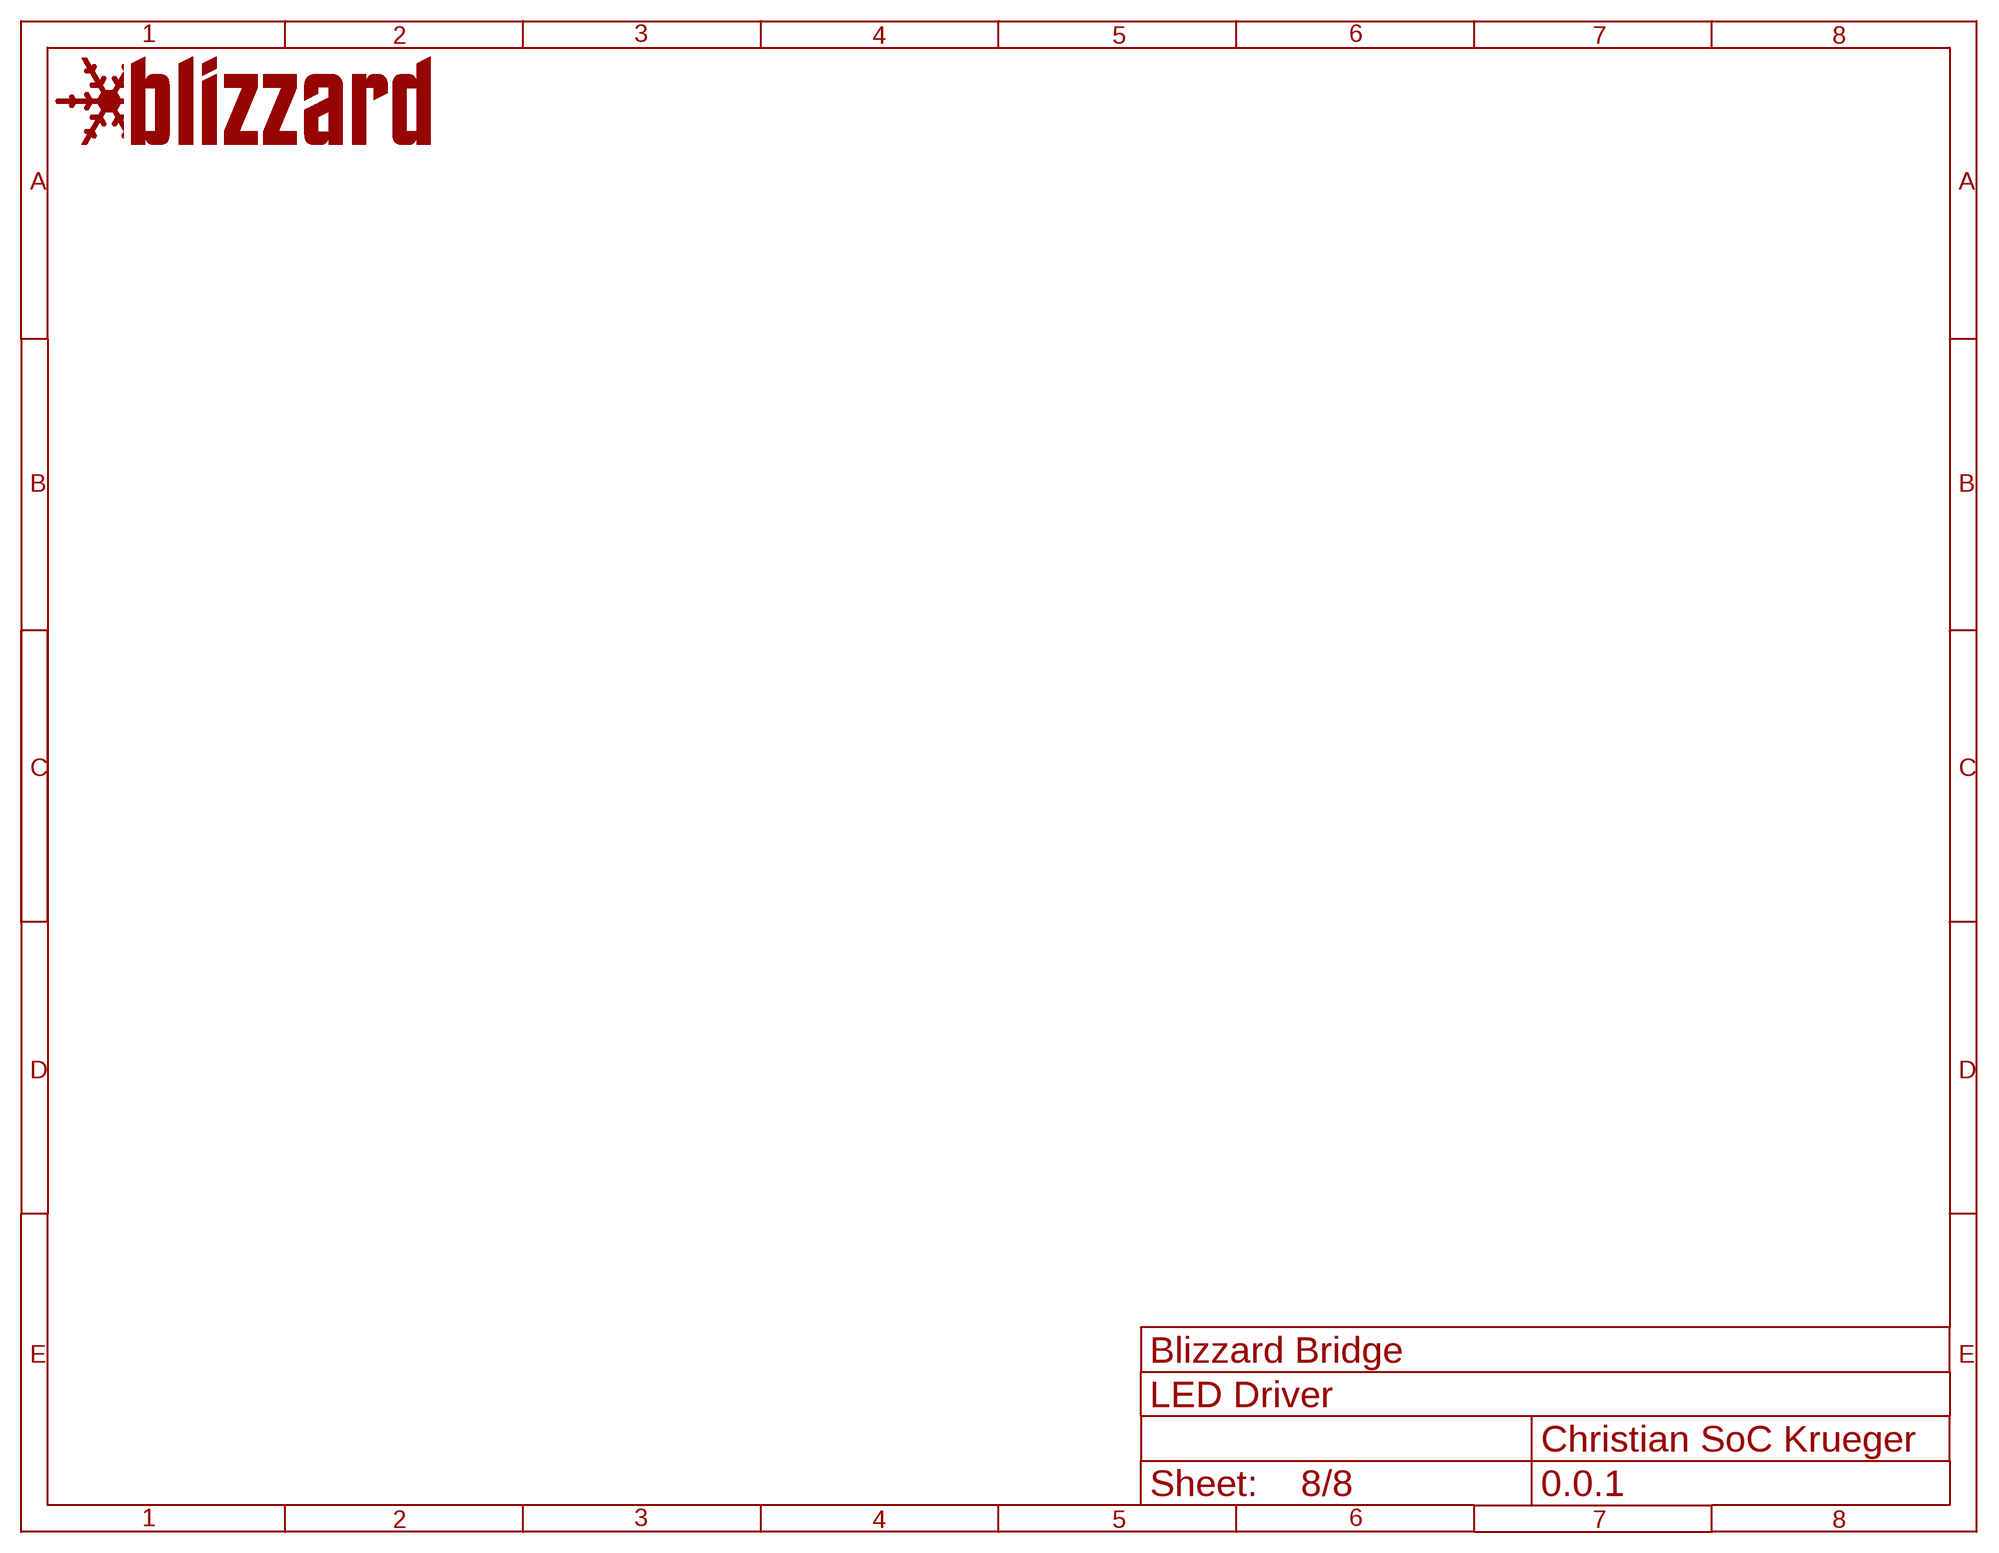
[diagram p7: schematic, sheet 8]
U$8 (BLIZZARD_FRAME_DEV): CDESC: LED Driver

## Library data of the parts
C1-C35 = Blizzard_Library:0603_CAP_DEV: 0603 Capacitor
D1 = Blizzard_Library:USB_ESD_DEV: SP0503BAHT USB ESD Protection; PN: SP0503BAHT
GND1-GND37 = Blizzard_Library:GND: GROUND
J1 J2 = Blizzard_Library:2_POS_XH_DEV: 2 Pos XH JST Connector
J3 = Blizzard_Library:13_POS_XH_DEV: 13 Pos XH JST
J4 = Blizzard_Library:6_POS_XH_DEV: 6 Postion JST XH
J5 = Blizzard_Library:8_POS_XH_DEV: 8 Pos XH JST
L1-L4 = Blizzard_Library:0603_IND_DEV: 0603 Inductor
NC1-NC17 NC26-NC32 = Blizzard_Library:NC: NC
Q1 Q2 = Blizzard_Library:SOT23_TRANS: 2N222 PNP Transitor; PN: MMBT2222A-FDICT-ND
R1-R33 = Blizzard_Library:0603_RES_DEV: 0603 Resister
U1 = Blizzard_Library:ESP_32_WROVER_I_PKG: ESP32-WROVER-I; PN: GC-ESP-WROVER-32
U2 = Blizzard_Library:LD1117S33CTR_DEV: LD1117S33CTR
U3 = Blizzard_Library:LAN9303_DEV: LAN9303 3 Port Ethernet RMII Switch; PN: LAN9303
U4 = Blizzard_Library:USB_TO_UART_DEV: SINGLE-CHIP USB-TO-UART BRIDGE PN: 336-1160-5-ND; PN: CP2102
U5 = Blizzard_Library:MAX_485_DEV: MAX 485 PN: MAX485CSA+-ND; PN: MAX485EESA+TCT-ND
U6 = Blizzard_Library:EL3H7_DEV: Everlight EL3H7-G Photocoupler; PN: EL3H7-G
U7 U8 = Blizzard_Library:TLP2362_DEV: Logic Output Optoisolator 10MBd Open Collector 3750Vrms 1 Channel 20kV/µs CMTI 6-SO, 5 Lead; PN: TLP2362
U9 = Blizzard_Library:RFM-0505S_DEV: Isolated Module DC DC Converter 1 Output 5V 200mA - 5V Input; PN: RFM-0505S
U10 = Blizzard_Library:WDMX_NANO_DEV: W-DMX Nano - It's made in Sweeden; PN: W-DMX Nano
VCC1-VCC43 = Blizzard_Library:VCC: VCC
X1 = Blizzard_Library:USB_ALI_DEV: ALI USB Micro B
X2 X3 = Blizzard_Library:J1B1211CCD_DEV: 1278-1052-ND 1 Port RJ45 Magjack Connector Through Hole 10/100 Base-T, AutoMDIX; PN: J1B1211CCD
Y1 = Blizzard_Library:ABLS-25.000MHZ-B4-F-T_DEV: 25MHz ±30ppm Crystal 18pF 40 Ohms HC-49/US 535-10235-1-ND